# EAGLE design HTC1080_breakout (EAGLE 7.7.0)
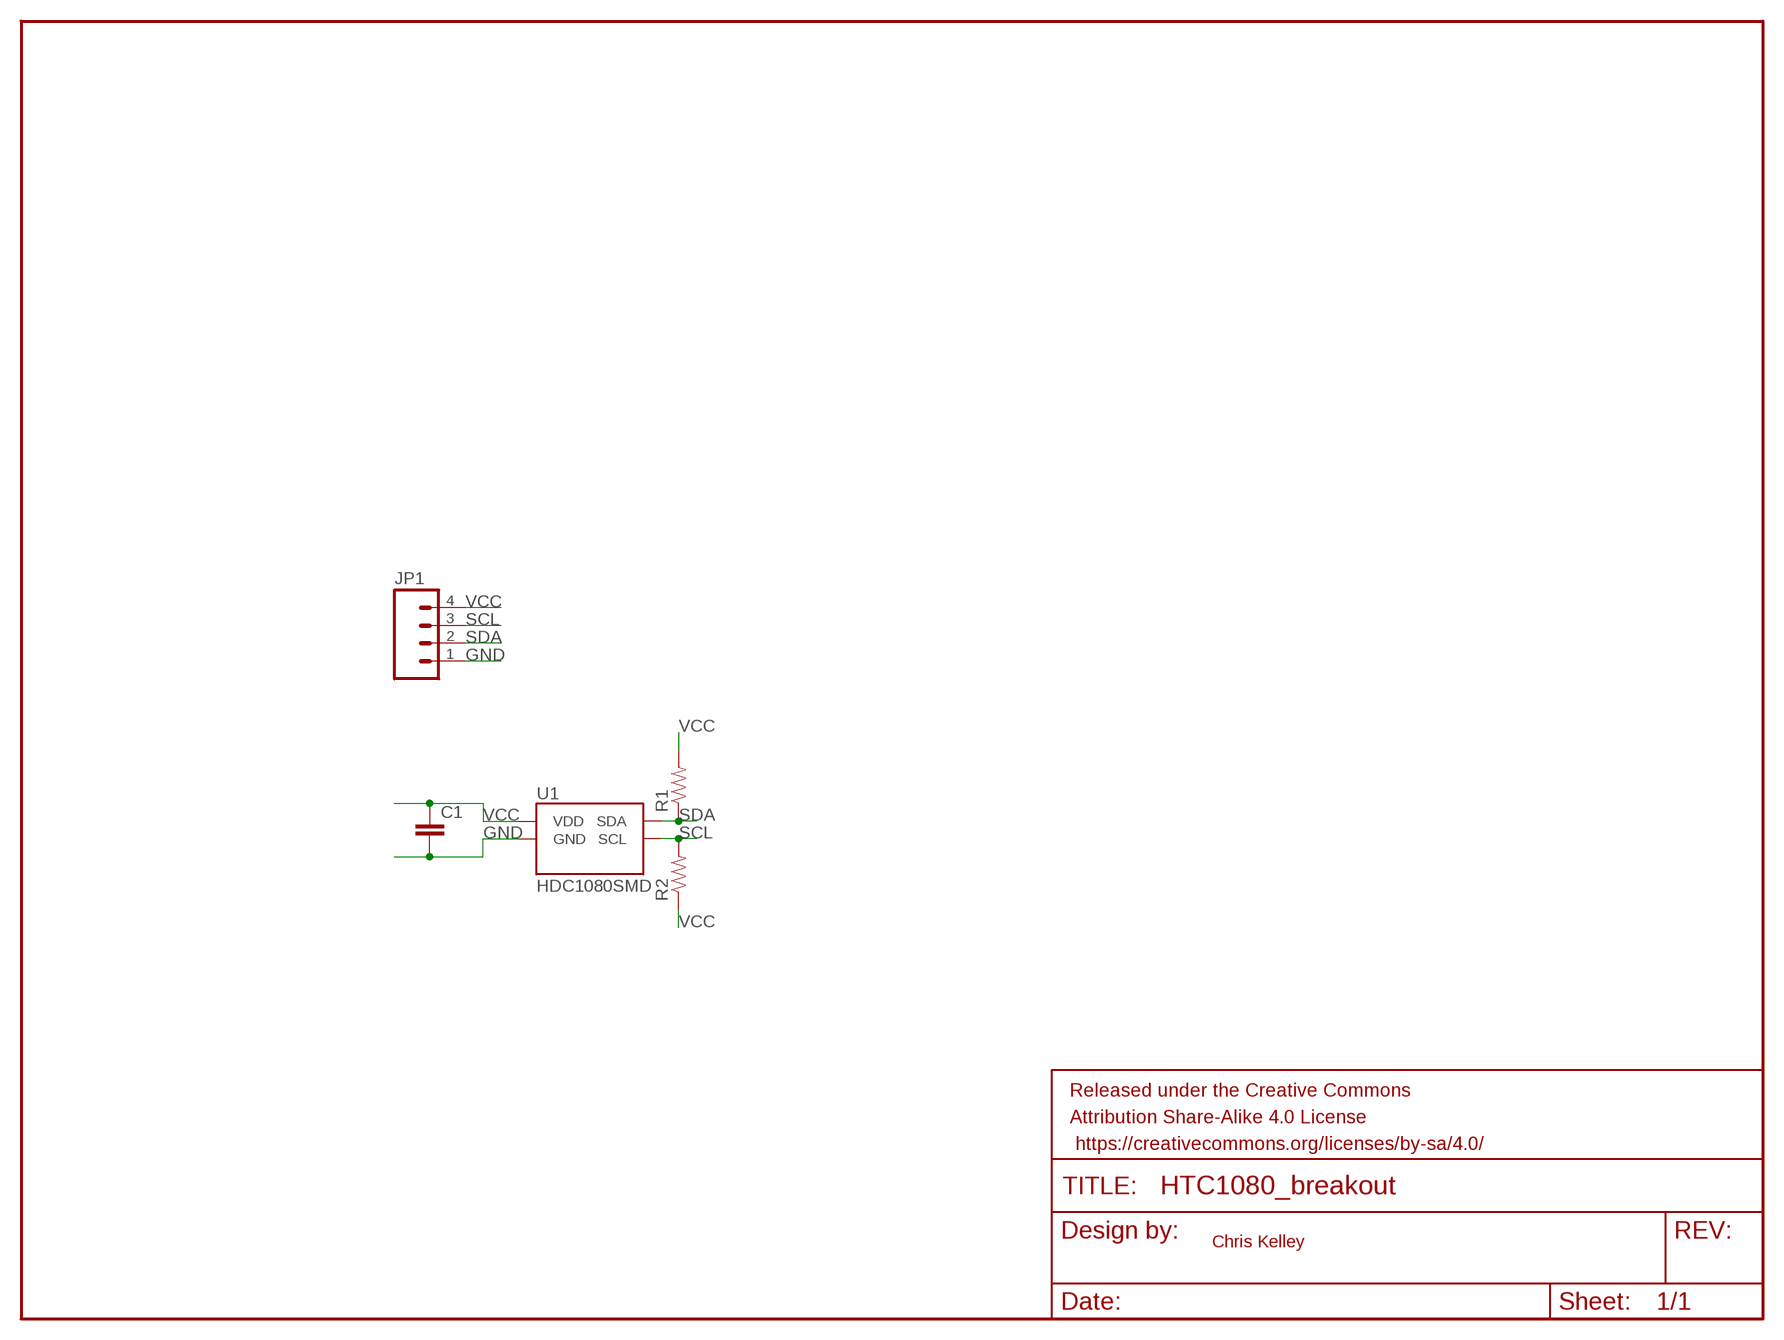
[diagram p0: schematic, sheet 1]

## Parts
C1  CAP0603-CAP  [0603-CAP]
FRAME1  FRAME-LETTER  [CREATIVE_COMMONS]
JP1  M04PTH  [1X04]
R1  RESISTOR0603-RES  [0603-RES]
R2  RESISTOR0603-RES  [0603-RES]
U1  HDC1080SMD  [TI-PWSON6-DMB]

## Nets
GND: C1.2 JP1.1 U1.GND
SCL: JP1.3 R2.2 U1.SCL
SDA: JP1.2 R1.1 U1.SDA
VCC: C1.1 JP1.4 R1.2 R2.1 U1.VDD

## Notes on the sheet
- Chris Kelley

## Library data of the parts
C1 = SparkFun-Passives:CAP: Capacitor Standard 0603 ceramic capacitor, and 0.1" leaded capacitor.
FRAME1 = SparkFun-Aesthetics:FRAME-LETTER: Schematic Frame Standard 8.5x11 US Letter frame
JP1 = SparkFun-Connectors:M04: Header 4 Standard 4-pin 0.1" header. Use with straight break away headers (SKU : PRT-00116), right angle break away headers (PRT-00553), swiss pins (PRT-00743), machine pins (PRT-00117), and female headers (PRT-00115). Molex polarized connector foot print use with SKU : PRT-08231 with associated crimp pins and housings. 1MM SMD Version SKU: PRT-10208
R1 R2 = SparkFun-Passives:RESISTOR: Resistor Basic schematic elements and footprints for 0603, 1206, and PTH resistors.
U1 = adam-sensors:HDC1080; PRODUCT_NAME: HDC1080; VENDOR_NAME: TI

## Board
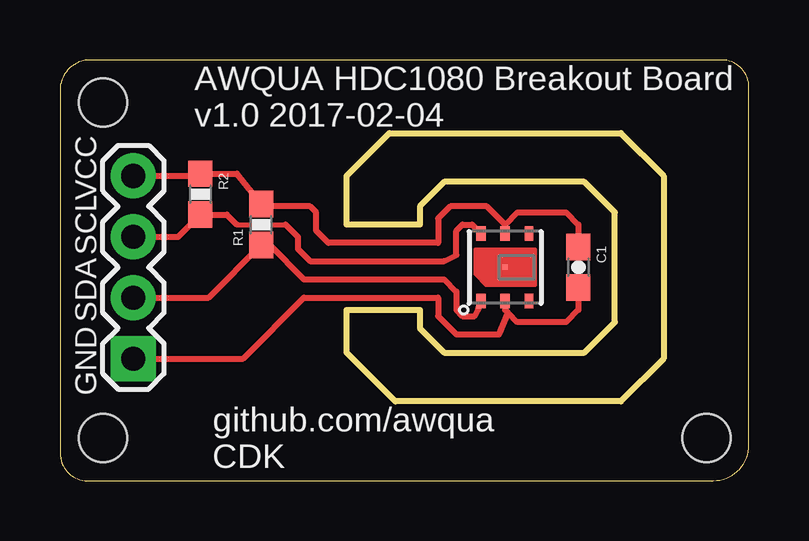
[diagram p1: board, top side]
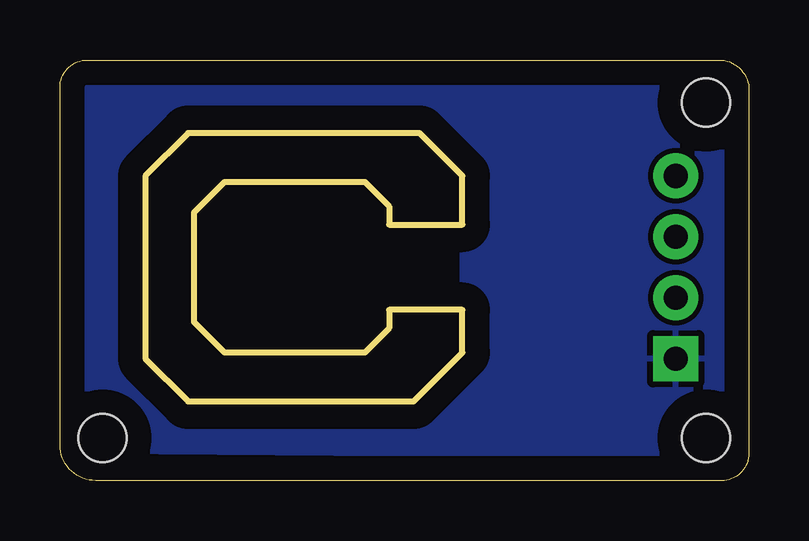
[diagram p2: board, bottom side, seen from below]

Size 28.71 x 17.53 mm. Coordinates in mm from the lower left corner, seen from the top.
Outline: 0.01,16.14 0.01,1.14 arc90 1.14,0 27.23,0 arc90 28.71,1.48 28.71,16.39 arc90 27.57,17.53 1.14,17.53 arc90 0.01,16.14
Outline: 11.94,10.67 11.94,12.7 13.72,14.48 23.37,14.48 25.15,12.7 25.15,5.08 23.37,3.3 13.98,3.3 11.94,5.33 11.94,7.11 14.99,7.11 14.99,6.35 16.01,5.33 21.85,5.33 23.12,6.6 23.12,11.18 21.85,12.45 16.01,12.45 14.99,11.43 14.99,10.67 11.94,10.67
Copper layers (1*16): Top 0.035mm / dielectric 1.5mm / Bottom 0.035mm
Design rules "default": minimum track width 10mil, minimum drill 24mil, track to track 8mil, track to pad 8mil, pad to pad 8mil, via to via 8mil, smd to smd 8mil, copper to edge 40mil, drill to drill 8mil, minimum pad ring 10mil, minimum via ring 8mil, stop-mask expansion 4mil, vias tented up to drill 0mil, thermal gap 10mil
Holes 2 mm at 1.78,15.75 1.78,1.78 26.93,1.78

### Footprints (pad centres in the part's own frame; a part is rotated, then mirrored left to right if it is on the bottom)
0603-CAP = smd 1.1 x 1: 1 -0.85,0; 2 0.85,0
1X04 = drill 1.016 pad 1.88 square: 1 0,0 | drill 1.016 pad 1.88: 2 2.54,0; 3 5.08,0; 4 7.62,0
0603-RES = smd 1.1 x 1: 1 -0.85,0; 2 0.85,0
TI-PWSON6-DMB = smd 0.6 x 0.4: GND 1.4,0; NC@1 -1.4,1; NC@6 1.4,1; SCL -1.4,-1; SDA 1.4,-1; VDD -1.4,0 | smd 0.2 x 0.2: NC@7 0,0

### Placement (x,y rotation side)
C1  21.6,8.89 270 top
FRAME1  14.74,-11.94 0 top  (outside the outline)
JP1  3.05,5.08 90 top
R1  8.39,10.67 90 top
R2  5.85,11.94 270 top
U1  18.55,8.89 270 top

### Tracks (layer width: path | path; a pad name or v marks a point on that pad's centre or on a via)
GND
  Top 0.254: C1.2 21.6,7.11 21.09,6.6 19.06,6.6 18.68,6.99 | U1.GND 18.55,7.11 18.68,6.99 | JP1.1 7.63,5.08 10.17,7.62 15.75,7.62 15.75,6.86 16.52,6.1 18.29,6.1 18.68,6.99
  pour Bottom: 0.51,17.02 29.47,17.27 29.47,9.65 24.14,9.4 23.88,12.45 22.87,13.72 13.98,13.72 11.94,11.94 11.94,5.33 14.48,4.57 22.1,4.57 24.14,6.6 24.39,9.4 28.96,9.4 29.47,1.27 0.26,1.02 0.26,16.76
SCL
  Top 0.203: 7.37,10.67 9.4,10.67
  Top 0.254: JP1.3 4.92,10.16 R2.2 6.95,11.09 7.37,10.67 | 9.4,10.67 9.91,10.16 9.91,9.65 10.42,9.14 16.01,9.14 16.52,9.4 16.52,10.41 16.77,10.67 17.17,10.67 U1.SCL
SDA
  Top 0.254: JP1.2 6.19,7.62 R1.1 8.73,9.82 10.17,8.38 16.01,8.38 16.52,7.87 16.52,7.11 16.77,6.86 17.28,6.86 17.42,7.11 U1.SDA
VCC
  Top 0.254: U1.VDD 18.55,10.67 | 18.55,10.67 19.06,11.18 21.09,11.18 21.6,10.67 C1.1 | JP1.4 5.76,12.7 R2.1 7.37,12.79 R1.2 8.73,11.43 10.42,11.43 10.67,11.18 10.67,10.41 11.18,9.91 15.75,9.91 15.75,10.92 16.26,11.43 17.79,11.43 18.55,10.67

### Text on the board
tPlace: AWQUA HDC1080 Breakout Board / v1.0 2017-02-04 | github.com/awqua / CDK
tNames: VCC | SCL | SDA | GND
Notes: Chris Kelley